# EAGLE design VL53L1X_Winkelplatine (EAGLE 7.6.0)
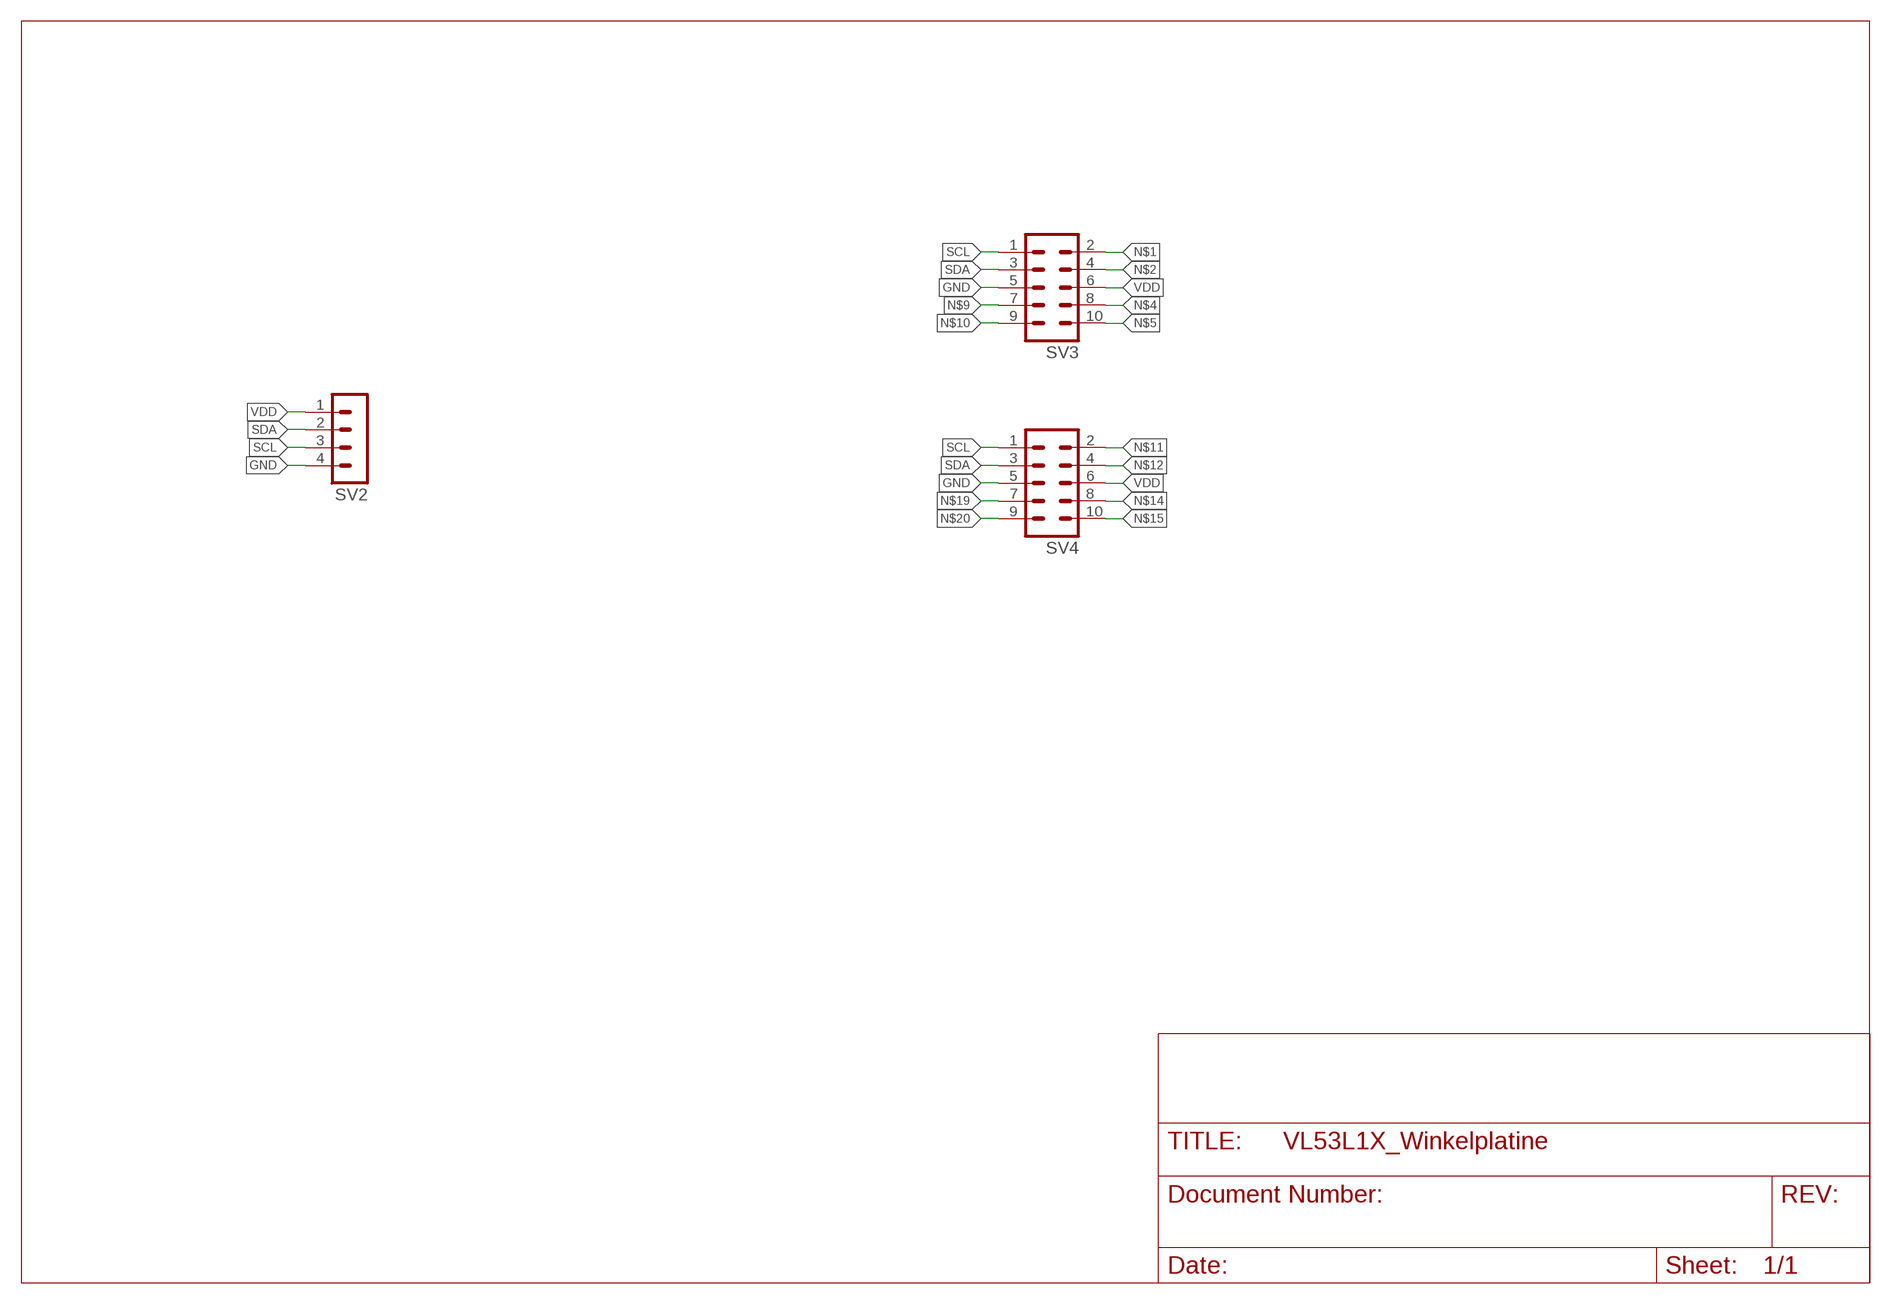
[diagram p0: schematic, sheet 1]

## Parts
SV2  MA04-1  [MA04-1]
SV3  MA05-2  [MA05-2]
SV4  MA05-2  [MA05-2]

## Nets
GND: SV2.4 SV3.5 SV4.5
N$1: SV3.2
N$2: SV3.4
N$4: SV3.8
N$5: SV3.10
N$9: SV3.7
N$10: SV3.9
N$11: SV4.2
N$12: SV4.4
N$14: SV4.8
N$15: SV4.10
N$19: SV4.7
N$20: SV4.9
SCL: SV2.3 SV3.1 SV4.1
SDA: SV2.2 SV3.3 SV4.3
VDD: SV2.1 SV3.6 SV4.6

## Library data of the parts
SV2 = con-lstb:MA04-1: PIN HEADER; OC_FARNELL: unknown; OC_NEWARK: unknown
SV3 SV4 = con-lstb:MA05-2: PIN HEADER; OC_FARNELL: unknown; OC_NEWARK: unknown

## Board
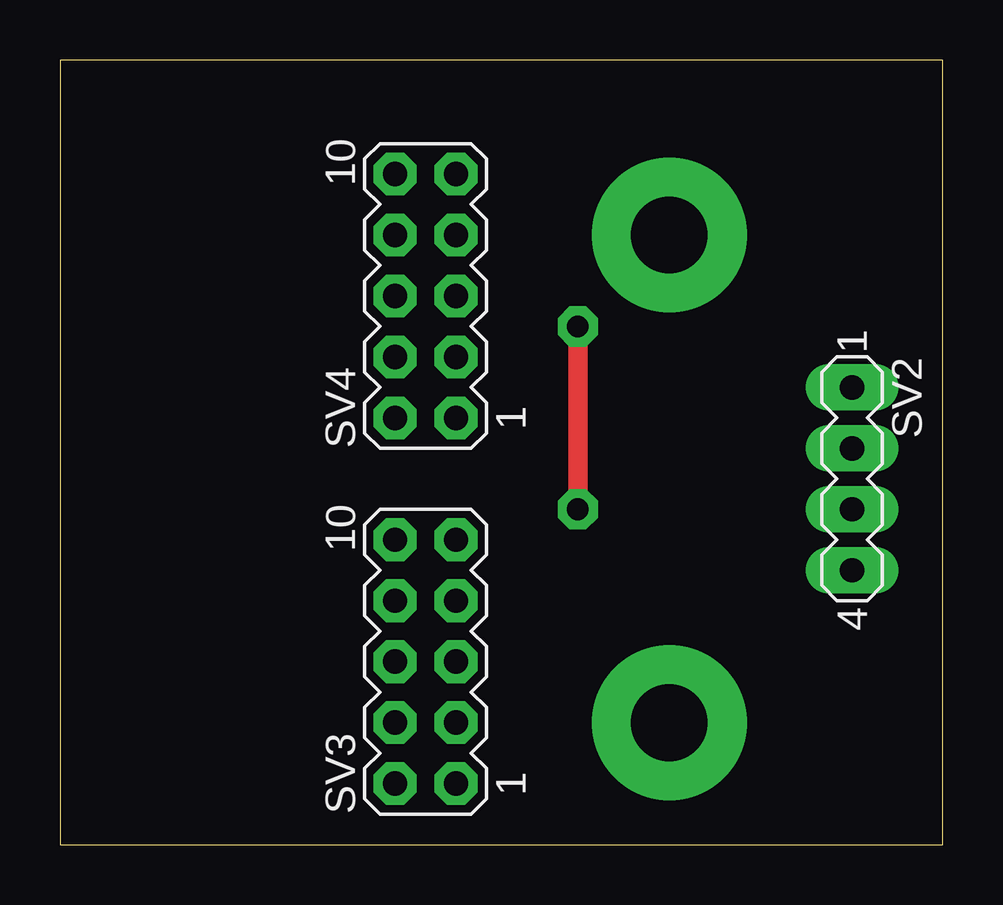
[diagram p1: board, top side]
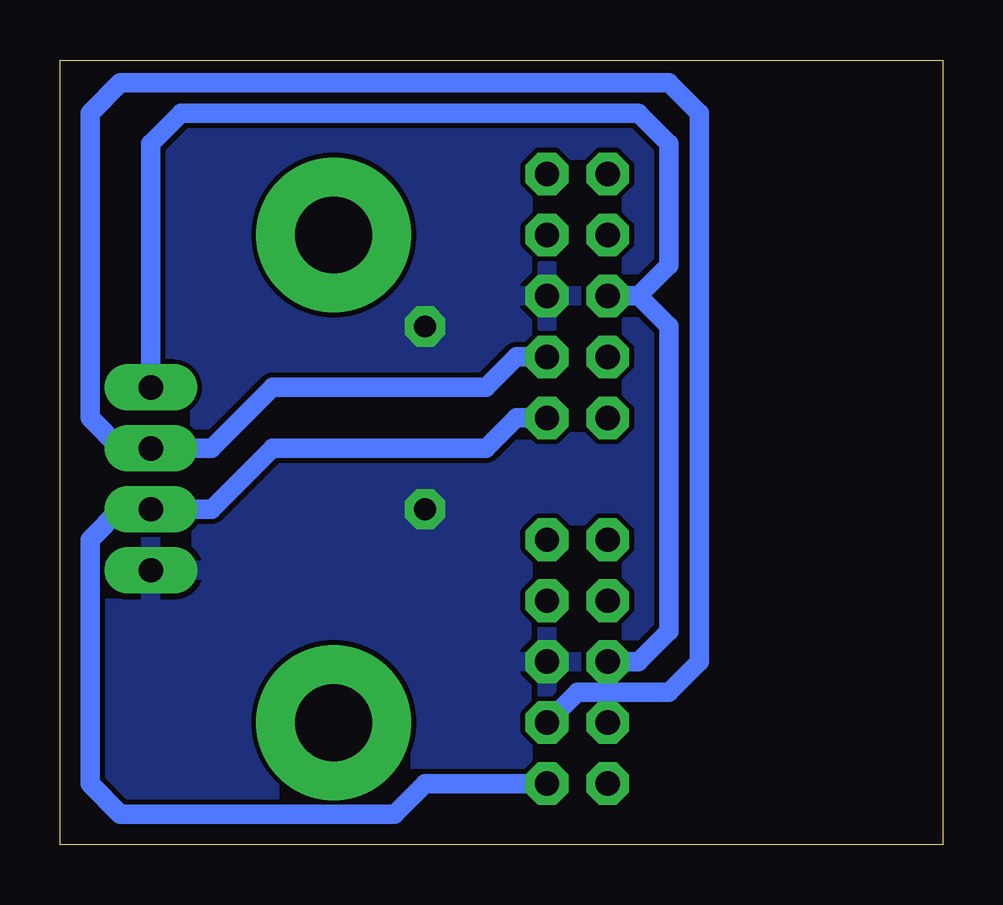
[diagram p2: board, bottom side, seen from below]

Size 36.81 x 32.69 mm. Coordinates in mm from the lower left corner, seen from the top.
Outline: 0,0 36.81,0 36.81,32.69 0,32.69 0,0
Copper layers (1*16): Top 0.035mm / dielectric 1.5mm / Bottom 0.035mm
Design rules "default": minimum track width 10mil, minimum drill 24mil, track to track 8mil, track to pad 8mil, pad to pad 8mil, via to via 8mil, smd to smd 8mil, copper to edge 40mil, drill to drill 8mil, minimum pad ring 10mil, minimum via ring 8mil, stop-mask expansion 4mil, vias tented up to drill 0mil, thermal gap 10mil

### Footprints (pad centres in the part's own frame; a part is rotated, then mirrored left to right if it is on the bottom)
MA04-1 = drill 1.016 pad 1.93 long: 1 -3.81,0; 2 -1.27,0; 3 1.27,0; 4 3.81,0
MA05-2 = drill 1.016 pad 1.778 octagon: 1 -5.08,-1.27; 2 -5.08,1.27; 3 -2.54,-1.27; 4 -2.54,1.27; 5 0,-1.27; 6 0,1.27; 7 2.54,-1.27; 8 2.54,1.27; 9 5.08,-1.27; 10 5.08,1.27

### Placement (x,y rotation side)
SV2  33.02,15.24 270 top
SV3  15.24,7.62 90 top
SV4  15.24,22.86 90 top

### Tracks (layer width: path | path; a pad name or v marks a point on that pad's centre or on a via)
GND  (via drill 0.9 pad 1.68)
  Top 0.813: v21.59,21.59 v21.59,13.97
  pour Bottom: 0,33.02 36.83,33.02 36.83,0 0,0
N$3  (via drill 3.2 pad 6.45)
  other vias: 25.4,25.4
N$6  (via drill 3.2 pad 6.45)
  other vias: 25.4,5.08
SCL
  Bottom 0.813: SV4.1 17.78,17.78 19.05,16.51 27.94,16.51 30.48,13.97 SV2.3 34.29,13.97 35.56,12.7 35.56,2.54 34.29,1.27 22.86,1.27 21.59,2.54 SV3.1
SDA
  Bottom 0.813: SV4.3 17.78,20.32 19.05,19.05 27.94,19.05 30.48,16.51 SV2.2 34.29,16.51 35.56,17.78 35.56,30.48 34.29,31.75 11.43,31.75 10.16,30.48 10.16,7.62 11.43,6.35 15.24,6.35 SV3.3
VDD
  Bottom 0.813: SV2.1 33.02,29.21 31.75,30.48 12.7,30.48 11.43,29.21 11.43,24.13 12.7,22.86 | 12.7,22.86 SV4.6 | SV3.6 12.7,7.62 11.43,8.89 11.43,21.59 12.7,22.86